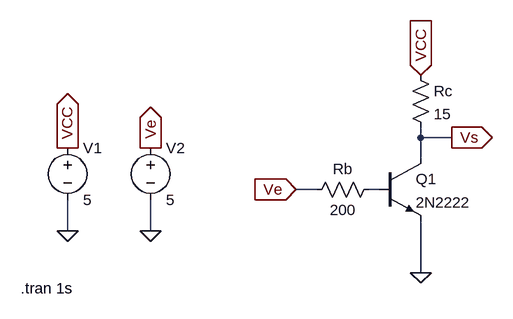
[diagram p0: schematic Draft3.asc]
Draft3.asc, the LTspice schematic file:
Version 4
SHEET 1 880 680
WIRE 336 0 336 -16
WIRE 384 0 336 0
WIRE 336 32 336 0
WIRE 176 80 144 80
WIRE 272 80 256 80
WIRE -208 144 -208 96
WIRE -80 144 -80 96
WIRE 336 208 336 128
FLAG 336 208 0
FLAG -208 144 0
FLAG -208 16 VCC
IOPIN -208 16 Out
FLAG -80 144 0
FLAG -80 16 Ve
IOPIN -80 16 Out
FLAG 144 80 Ve
IOPIN 144 80 In
FLAG 336 -96 VCC
IOPIN 336 -96 In
FLAG 384 0 Vs
IOPIN 384 0 Out
SYMBOL npn 272 32 R0
SYMATTR InstName Q1
SYMATTR Value 2N2222
SYMBOL res 320 -112 R0
SYMATTR InstName Rc
SYMATTR Value 15
SYMBOL voltage -208 0 R0
SYMATTR InstName V1
SYMATTR Value 5
SYMBOL voltage -80 0 R0
WINDOW 123 0 0 Left 0
WINDOW 39 0 0 Left 0
SYMATTR InstName V2
SYMATTR Value 5
SYMBOL res 272 64 R90
WINDOW 0 0 56 VBottom 2
WINDOW 3 32 56 VTop 2
SYMATTR InstName Rb
SYMATTR Value 200
TEXT -280 232 Left 2 !.tran 1s

The netlist it stands for:
* Draft3.asc
Q1 Vs N001 0 0 2N2222
Rc VCC Vs 15
V1 VCC 0 5
V2 Ve 0 5
Rb N001 Ve 200
.model NPN NPN
.model PNP PNP
.lib standard.bjt
.tran 1s
.backanno
.end